# Altium schematic sheet PressureSensor1.SchDoc
size A4; SheetNumber: 8; SheetTotal: 11
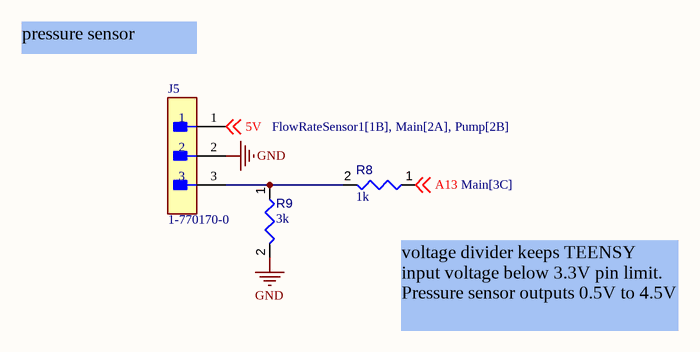
[diagram p0: PressureSensor1.SchDoc]

## Parts
J5  1-770170-0  [FP-1-770170-0-MFG]
R8  value 1k  [RESC0402(1005)_L]  (hidden comment: 1KR2J)
R9  value 3k  [RESC0402(1005)_L]  (hidden comment: 3KR2F)

## Nets
GND: J5.2 R9.2
5V: J5.1 ; off-sheet 5V
A13: R8.1 ; off-sheet A13
NetJ5_3: J5.3 R8.2 R9.1

## Notes on the sheet
- pressure sensor
- (near R8) voltage divider keeps TEENSY input voltage below 3.3V pin limit. Pressure sensor outputs 0.5V to 4.5V

## Library data of the parts
J5 = CMP-03369-000023-1: CONN HEADER VERT 3POS 4.14MM; Manufacturer: TE Connectivity; Voltage Rating: 600V; Standoff Height: 0.63mm; Conn Gender: Male; Number Of Contacts: 3; Conn Orientation: Vertical; Current Rating: 9.5A; Temperature Range Low: -55°C; Device Class L3: unset; Temperature Range High: +105°C; Octopart: https://octopart.com/1-770170-0-te+connectivity-46505214; Mouser Description: Pin & Socket Connectors HEADER 3 POS TIN IN LINE; Package: 1-770170-0; Pitch: 4.14mm; ComponentLink2Description: Datasheet; Category: Conn; Number Of Rows: 1; Device Class L1: Connectors; Height: 14.51mm; Contact Material: Gold,Nickel; Digikey Description: CONN HEADER VERT 3POS 4.14MM; ComponentLink2URL: https://www.te.com/commerce/DocumentDelivery/DDEController?Action=showdoc&DocId=Customer+Drawing%7F770170%7FM2%7Fpdf%7FEnglish%7FENG_CD_770170_M2.pdf%7F1-770170-0; Automotive: No; Temperature: -55°C to +105°C; Manufacturer Part Number: 1-770170-0; Lead Free: Yes; Device Class L2: Headers and Wire Housings; RoHS: TRUE
R8 = CMP-009-00075-2: 1K 0.063W 5% 0402 (1005 Metric)  SMD; Power: 63mW; Pins: 2; Mounting Technology: SMT; Case/Package: 0402; Tolerance: 5%
R9 = CMP-009-00099-2: 3K 0.063W 1% 0402 (1005 Metric)  SMD; Power: 63mW; Case/Package: 0402; Tolerance: 1%; Mounting Technology: SMT; Pins: 2